# Altium schematic sheet io.SchDoc
size A3; SheetNumber: 3; SheetTotal: 4
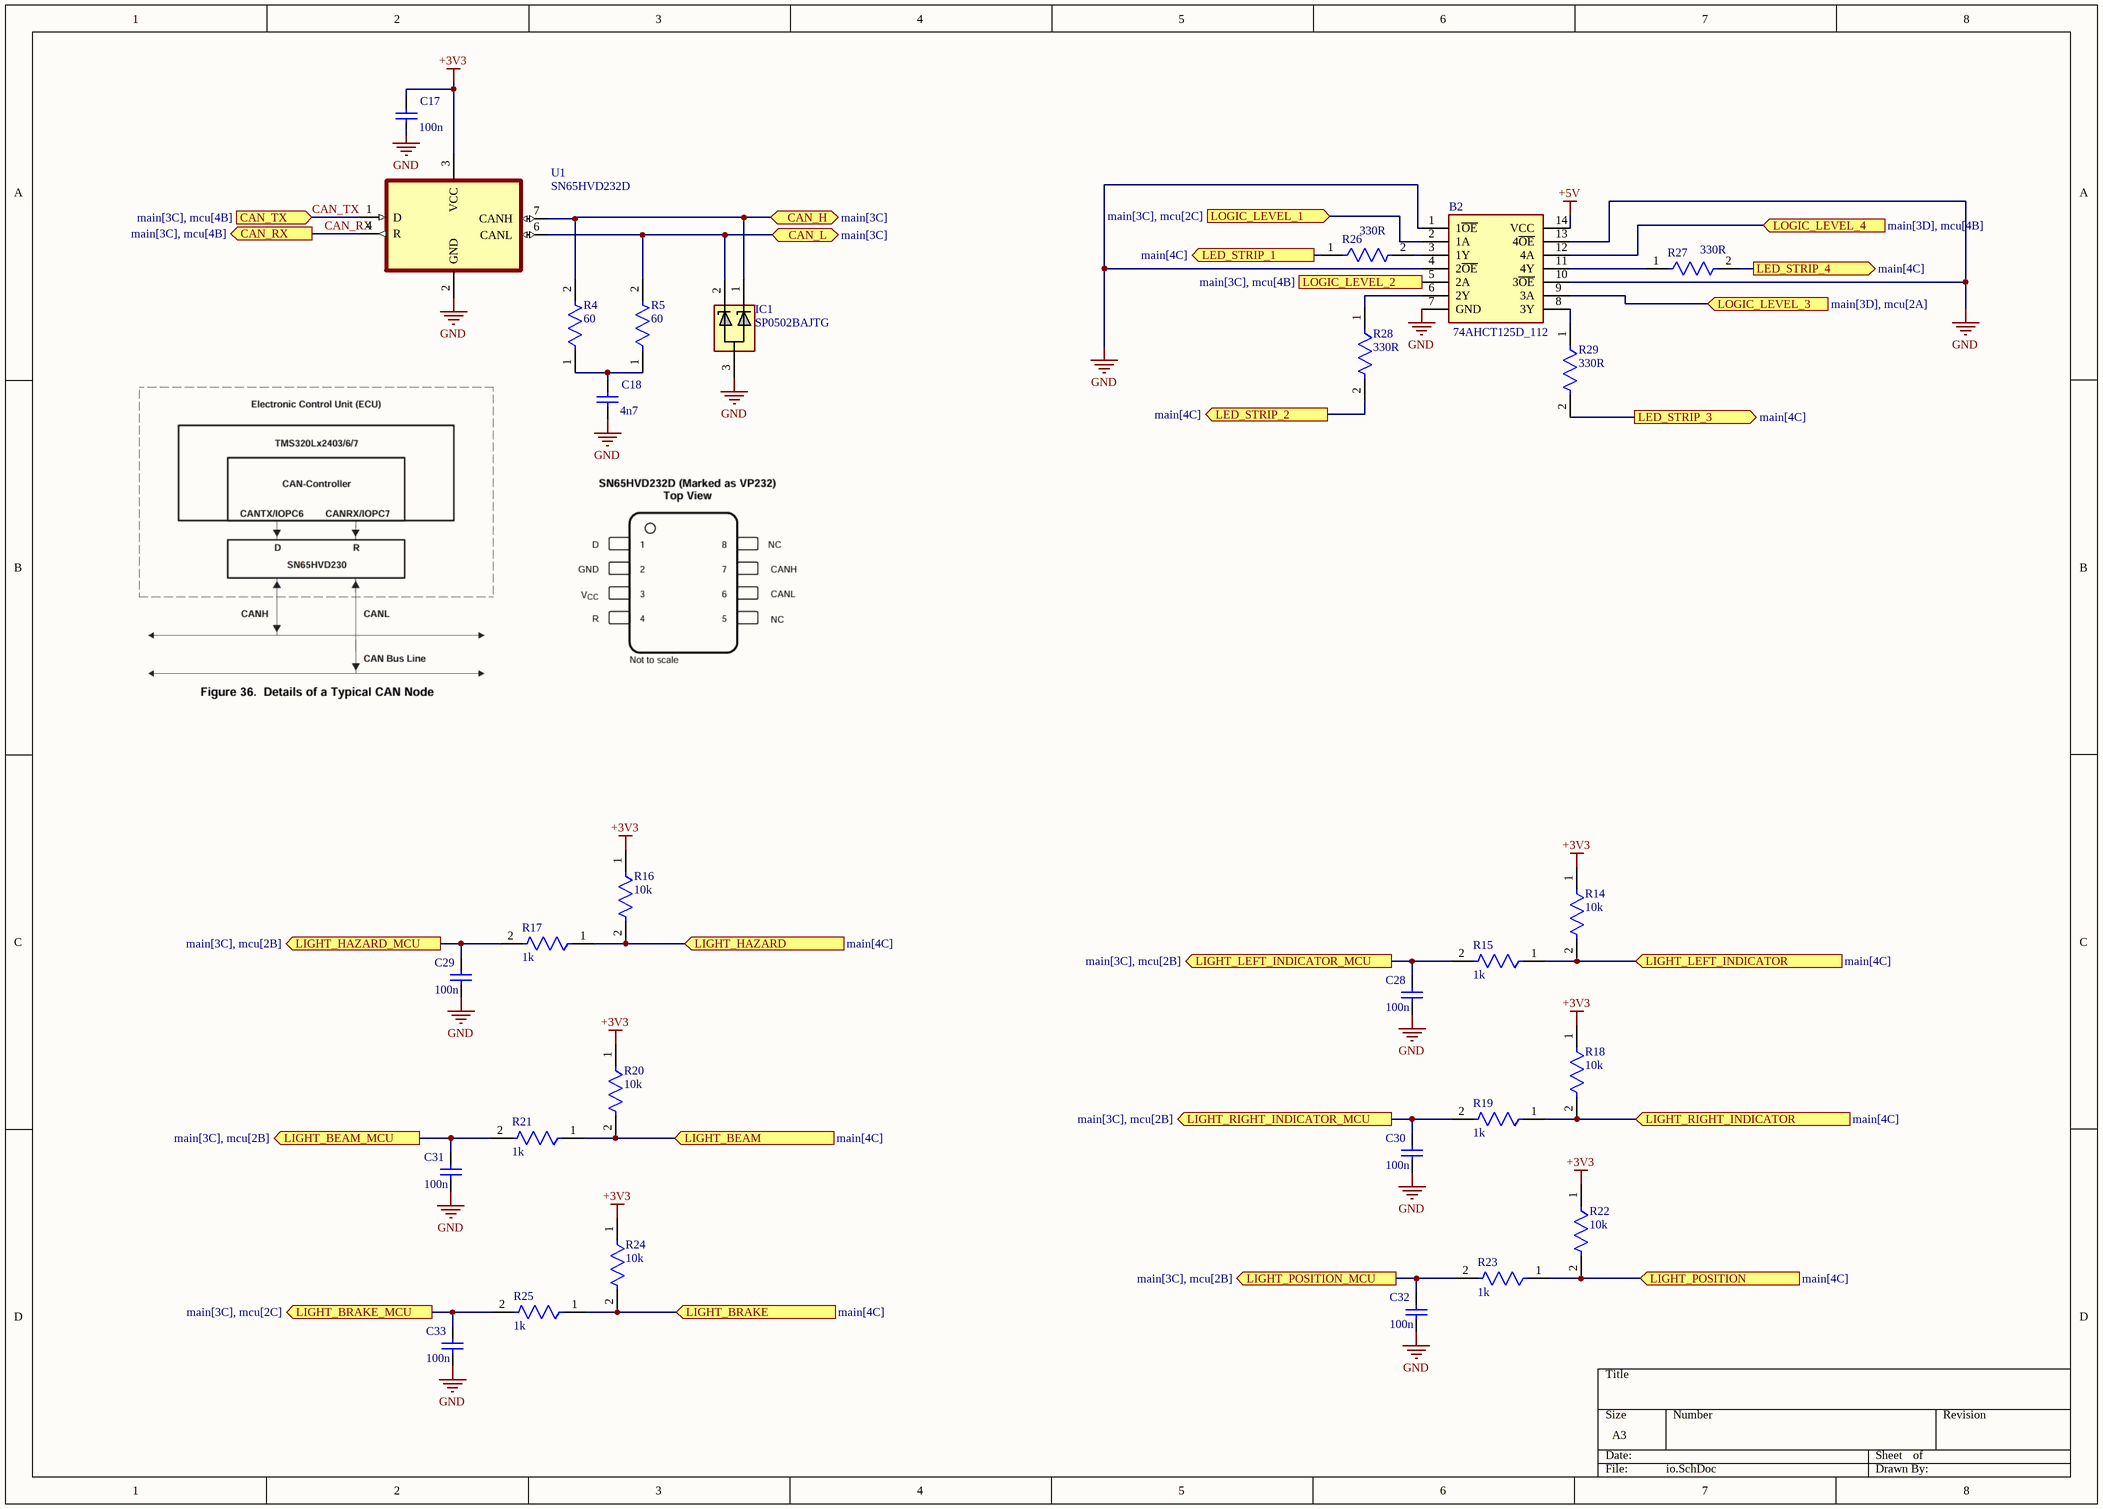
[diagram p0: io.SchDoc]

## Parts
B2  74AHCT125D_112  [74AHCT125D_112]
C17  100n  [CAPC1206(3216)150_L]
C18  4n7  [CAPC1206(3216)150_L]
C28  100n  [CAPC1206(3216)150_L]
C29  100n  [CAPC1206(3216)150_L]
C30  100n  [CAPC1206(3216)150_L]
C31  100n  [CAPC1206(3216)150_L]
C32  100n  [CAPC1206(3216)150_L]
C33  100n  [CAPC1206(3216)150_L]
IC1  SP0502BAJTG  [SOT132P220X110-3N]
R4  60  [FP-RK73H2B-MFG]
R5  60  [FP-RK73H2B-MFG]
R14  10k  [FP-RK73H2B-MFG]
R15  1k  [FP-RK73H2B-MFG]
R16  10k  [FP-RK73H2B-MFG]
R17  1k  [FP-RK73H2B-MFG]
R18  10k  [FP-RK73H2B-MFG]
R19  1k  [FP-RK73H2B-MFG]
R20  10k  [FP-RK73H2B-MFG]
R21  1k  [FP-RK73H2B-MFG]
R22  10k  [FP-RK73H2B-MFG]
R23  1k  [FP-RK73H2B-MFG]
R24  10k  [FP-RK73H2B-MFG]
R25  1k  [FP-RK73H2B-MFG]
R26  330R  [FP-RK73H2B-MFG]
R27  330R  [FP-RK73H2B-MFG]
R28  330R  [FP-RK73H2B-MFG]
R29  330R  [FP-RK73H2B-MFG]
U1  SN65HVD232D  [SN65HVD232D]

## Ports
CAN_H (bidir, see main[3C]), CAN_L (bidir, see main[3C]), CAN_RX (out, see main[3C], mcu[4B]), CAN_TX (in, see main[3C], mcu[4B]), LED_STRIP_1 (out, see main[4C]), LED_STRIP_2 (out, see main[4C]), LED_STRIP_3 (out, see main[4C]), LED_STRIP_4 (out, see main[4C]), LIGHT_BEAM (in, see main[4C]), LIGHT_BEAM_MCU (out, see main[3C], mcu[2B]), LIGHT_BRAKE (in, see main[4C]), LIGHT_BRAKE_MCU (out, see main[3C], mcu[2C]), LIGHT_HAZARD (in, see main[4C]), LIGHT_HAZARD_MCU (out, see main[3C], mcu[2B]), LIGHT_LEFT_INDICATOR (in, see main[4C]), LIGHT_LEFT_INDICATOR_MCU (out, see main[3C], mcu[2B]), LIGHT_POSITION (in, see main[4C]), LIGHT_POSITION_MCU (out, see main[3C], mcu[2B]), LIGHT_RIGHT_INDICATOR (in, see main[4C]), LIGHT_RIGHT_INDICATOR_MCU (out, see main[3C], mcu[2B]), LOGIC_LEVEL_1 (in, see main[3C], mcu[2C]), LOGIC_LEVEL_2 (in, see main[3C], mcu[4B]), LOGIC_LEVEL_3 (in, see main[3D], mcu[2A]), LOGIC_LEVEL_4 (in, see main[3D], mcu[4B])

## Nets
+3V3: C17.1 R14.1 R16.1 R18.1 R20.1 R22.1 R24.1 U1.3(VCC)
+5V: B2.14(VCC)
GND: B2.1(1~{OE}) B2.4(2~{OE}) B2.7(GND) B2.10(3~{OE}) B2.13(4~{OE}) C17.2 C18.2 C28.2 C29.2 C30.2 C31.2 C32.2 C33.2 IC1.3 U1.2(GND)
CAN_H: IC1.1 R4.2 U1.7(CANH) ; port CAN_H
CAN_L: IC1.2 R5.2 U1.6(CANL) ; port CAN_L
CAN_RX: U1.4(R) ; port CAN_RX
CAN_TX: U1.1(D) ; port CAN_TX
LED_STRIP_1: R26.1 ; port LED_STRIP_1
LED_STRIP_2: R28.2 ; port LED_STRIP_2
LED_STRIP_3: R29.2 ; port LED_STRIP_3
LED_STRIP_4: R27.2 ; port LED_STRIP_4
LIGHT_BEAM: R20.2 R21.1 ; port LIGHT_BEAM
LIGHT_BEAM_MCU: C31.1 R21.2 ; port LIGHT_BEAM_MCU
LIGHT_BRAKE: R24.2 R25.1 ; port LIGHT_BRAKE
LIGHT_BRAKE_MCU: C33.1 R25.2 ; port LIGHT_BRAKE_MCU
LIGHT_HAZARD: R16.2 R17.1 ; port LIGHT_HAZARD
LIGHT_HAZARD_MCU: C29.1 R17.2 ; port LIGHT_HAZARD_MCU
LIGHT_LEFT_INDICATOR: R14.2 R15.1 ; port LIGHT_LEFT_INDICATOR
LIGHT_LEFT_INDICATOR_MCU: C28.1 R15.2 ; port LIGHT_LEFT_INDICATOR_MCU
LIGHT_POSITION: R22.2 R23.1 ; port LIGHT_POSITION
LIGHT_POSITION_MCU: C32.1 R23.2 ; port LIGHT_POSITION_MCU
LIGHT_RIGHT_INDICATOR: R18.2 R19.1 ; port LIGHT_RIGHT_INDICATOR
LIGHT_RIGHT_INDICATOR_MCU: C30.1 R19.2 ; port LIGHT_RIGHT_INDICATOR_MCU
LOGIC_LEVEL_1: B2.2(1A) ; port LOGIC_LEVEL_1
LOGIC_LEVEL_2: B2.5(2A) ; port LOGIC_LEVEL_2
LOGIC_LEVEL_3: B2.9(3A) ; port LOGIC_LEVEL_3
LOGIC_LEVEL_4: B2.12(4A) ; port LOGIC_LEVEL_4
NetB2_3: B2.3(1Y) R26.2
NetB2_6: B2.6(2Y) R28.1
NetB2_8: B2.8(3Y) R29.1
NetB2_11: B2.11(4Y) R27.1
NetC18_1: C18.1 R4.1 R5.1

## Library data of the parts
B2 = 74AHCT125D_112: 74AHC(T)125 - Quad buffer/line driver; 3-state@en-us; Manufacturer_Name: Nexperia; Manufacturer_Part_Number: 74AHCT125D,112; Geometry.Height: 1.75mm; Mouser Part Number: 771-AHCT125D112; Mouser Price/Stock: https://www.mouser.com/Search/Refine.aspx?Keyword=771-AHCT125D112; Arrow Part Number: 74AHCT125D,112; Arrow Price/Stock: https://www.arrow.com/en/products/74ahct125d112/nexperia?region=europe; Datasheet Link: https://assets.nexperia.com/documents/data-sheet/74AHC_AHCT125.pdf
C17 C18 C28-C33 = CMP-1037-04778-1: CAP 1.8uF 10V ±5% 1206 (3216 Metric) Thickness 1.45mm SMD; Case-EIA: 1206; Tolerance: Â±5%; Case-Metric: 3216; Technology: SMT; Value: 1.8uF; Rated Voltage: 10 V; Max Thickness: 1.45 mm
IC1 = SP0502BAJTG: Integrated Circuit; Manufacturer_Name: LITTELFUSE; Datasheet Link: https://www.littelfuse.com/~/media/electronics/datasheets/tvs_diode_arrays/littelfuse_tvs_diode_array_sp05_datasheet.pdf.pdf; Height: 1.1mm; Manufacturer_Part_Number: SP0502BAJTG; Mouser Part Number: 576-SP0502BAJTG; Mouser Price/Stock: https://www.mouser.co.uk/ProductDetail/Littelfuse/SP0502BAJTG?qs=RnOBYWd%2Fz7cttN1Mwg4HWA%3D%3D; Arrow Part Number: SP0502BAJTG; Arrow Price/Stock: https://www.arrow.com/en/products/sp0502bajtg/littelfuse?region=nac
R4 R5 R14-R29 = CMP-04015-098385-1: 40.2kΩ ±1% 0.25W Chip Resistor 1206 Thick Film AEC-Q200 Qualified; Resistance: 40.2kR; Voltage Rating (DC): 200V; Temperature Coefficient: 100ppm/°C; Power Rating: 250mW; Tolerance: 1%; Package Quantity: 5000; Length: 3.2mm; Termination: SMD/SMT; Lead Free: Contains Lead; Case Code (Imperial): 1206; Case/Package: 1206; Voltage Rating: 200V; Case Code (Metric): 3216; Max Operating Temperature: 155°C; Packaging: Tape and Reel; Width: 1.6mm; Series: RK73H; Min Operating Temperature: -55°C; RoHS Compliant: No; Height: 0.6mm
U1 = SN65HVD232D: Texas Instruments - SN65HVD232DR - Can Transceiver, 1MBPS, 1/1, 3.3V, SOIC-8, Full Reel; Manufacturer Lifecycle Status: ACTIVE; Max Supply Voltage: 3.6V; Min Supply Voltage: 3V; Nominal Supply Current: 17mA; Number of Drivers: 1; SnapEDA_Link: https://www.snapeda.com/parts/SN65HVD232D/Texas+Instruments/view-part/?ref=snap; Package: SOIC-8 Texas Instruments; Value: *; MF: Texas Instruments; MP: SN65HVD232D; Check_prices: https://www.snapeda.com/parts/SN65HVD232D/Texas+Instruments/view-part/?ref=eda; Supplier: Arrow Electronics; Supplier Part Number: SN65HVD232DR; Manufacturer: Texas Instruments; Manufacturer Part Number: SN65HVD232DR; RoHS: Compliant; Category: CAN Transceivers; Stock: 10000; Pricing: 2500=1,1159, 5000=1,076, 7500=1,062 (USD); Case/Package: SOIC; Data Rate: 1Mbps; Height: 1.75mm; Lead Free: Lead Free; Length: 4.9mm; Lifecycle Status: Production; Max Operating Temperature: 85°C; Min Operating Temperature: -40°C; Pins: 8; Number of Receive Buffers: 1; Number of Receivers: 1; Number of Transceivers: 1; Number of Transmit Buffers: 1; Packaging: Cut Tape; Radiation Hardening: No; REACH SVHC: No; Schedule B: 8542390000, 8542390000|8542390000|8542390000|8542390000|8542390000; Thickness: 1.58mm; Weight: 72.603129mg; Width: 3.91mm; ComponentLink1URL: https://octopart.com:443/opatz8j6/c1?t=KNMFt9M64p-_id6rZ0-P1CX6CGmvk_NFg0bt7DHXbi_P10EFF0MZE_9gM8ERckOxIywTBgDrXd4Bw1XwEAcVVdK92p9CEfdSNaVajf6_bxnez3EeN1RE1wZBaojbXTwQ_101S7Bb856c3hUAWErS0_zGIM1B6Z6dFQwv_Ps2SUdVVUCjmJkLnMLZKTBWfnIVcgJIheW78JYanUyW_1u-I93chBuiSPXQYIk2xXb9JgOyrE9lHEnesRSQq9luJOd1yknyGQP0N3Is0_dGM9QrGV5UOgjoada9tMnQwKJP8gahr3iTK59XJFH6OfbHTOm3R9BdESCrBMbrE2MVOGPPkVOTrqf0YMovDpmf-konbncFnSES8CNOhHqMwHv2HEwKcPoK44nl&src-supplier=Texas+Instruments; ComponentLink1Description: https://octopart.com:443/opatz8j6/c1?t=KNMFt9M64p-_id6rZ0-P1CX6CGmvk_NFg0bt7DHXbi_P10EFF0MZE_9gM8ERckOxIywTBgDrXd4Bw1XwEAcVVdK92p9CEfdSNaVajf6_bxnez3EeN1RE1wZBaojbXTwQ_101S7Bb856c3hUAWErS0_zGIM1B6Z6dFQwv_Ps2SUdVVUCjmJkLnMLZKTBWfnIVcgJIheW78JYanUyW_1u-I93chBuiSPXQYIk2xXb9JgOyrE9lHEnesRSQq9luJOd1yknyGQP0N3Is0_dGM9QrGV5UOgjoada9tMnQwKJP8gahr3iTK59XJFH6OfbHTOm3R9BdESCrBMbrE2MVOGPPkVOTrqf0YMovDpmf-konbncFnSES8CNOhHqMwHv2HEwKcPoK44nl&src-supplier=Texas+Instruments; ComponentLink2URL: https://sigma.octopart.com:443/49249642/technical_drawing/Texas-Instruments-SN65HVD232DR.pdf?src-supplier=Texas+Instruments; ComponentLink2Description: https://sigma.octopart.com:443/49249642/technical_drawing/Texas-Instruments-SN65HVD232DR.pdf?src-supplier=Texas+Instruments; ComponentLink3URL: https://datasheet.octopart.com:443/SN65HVD232DR-Texas-Instruments-datasheet-81447765.pdf?src-supplier=Upverter; ComponentLink3Description: https://datasheet.octopart.com:443/SN65HVD232DR-Texas-Instruments-datasheet-81447765.pdf?src-supplier=Upverter; ComponentLink4URL: https://datasheet.octopart.com:443/SN65HVD232DR-Texas-Instruments-datasheet-37140773.pdf?src-supplier=Newark; ComponentLink4Description: https://datasheet.octopart.com:443/SN65HVD232DR-Texas-Instruments-datasheet-37140773.pdf?src-supplier=Newark; ComponentLink5URL: https://datasheet.octopart.com:443/SN65HVD232DR-Texas-Instruments-datasheet-14436966.pdf?src-supplier=Newark; ComponentLink5Description: https://datasheet.octopart.com:443/SN65HVD232DR-Texas-Instruments-datasheet-14436966.pdf?src-supplier=Newark; ComponentLink6URL: https://datasheet.octopart.com:443/SN65HVD232DR-Texas-Instruments-datasheet-58296547.pdf?src-supplier=Newark; ComponentLink6Description: https://datasheet.octopart.com:443/SN65HVD232DR-Texas-Instruments-datasheet-58296547.pdf?src-supplier=Newark; ComponentLink7URL: https://datasheet.octopart.com:443/SN65HVD232DR-Texas-Instruments-datasheet-48117850.pdf?src-supplier=Newark; ComponentLink7Description: https://datasheet.octopart.com:443/SN65HVD232DR-Texas-Instruments-datasheet-48117850.pdf?src-supplier=Newark; ComponentLink8URL: https://datasheet.octopart.com:443/SN65HVD232DR-Texas-Instruments-datasheet-10256024.pdf?src-supplier=Arrow+Electronics; ComponentLink8Description: https://datasheet.octopart.com:443/SN65HVD232DR-Texas-Instruments-datasheet-10256024.pdf?src-supplier=Arrow+Electronics; ComponentLink9URL: https://datasheet.octopart.com:443/SN65HVD232DR-Texas-Instruments-datasheet-149765.pdf?src-supplier=Mouser; ComponentLink9Description: https://datasheet.octopart.com:443/SN65HVD232DR-Texas-Instruments-datasheet-149765.pdf?src-supplier=Mouser; ComponentLink10URL: https://datasheet.octopart.com:443/SN65HVD232DR-Texas-Instruments-datasheet-62292544.pdf?src-supplier=Farnell; ComponentLink10Description: https://datasheet.octopart.com:443/SN65HVD232DR-Texas-Instruments-datasheet-62292544.pdf?src-supplier=Farnell; ComponentLink11URL: https://datasheet.octopart.com:443/SN65HVD232DR-Texas-Instruments-datasheet-164416263.pdf?src-supplier=SHENGYU+ELECTRONICS; ComponentLink11Description: https://datasheet.octopart.com:443/SN65HVD232DR-Texas-Instruments-datasheet-164416263.pdf?src-supplier=SHENGYU+ELECTRONICS; ComponentLink12URL: https://datasheet.octopart.com:443/SN65HVD232DR-Texas-Instruments-datasheet-159115712.pdf?src-supplier=LCSC; ComponentLink12Description: https://datasheet.octopart.com:443/SN65HVD232DR-Texas-Instruments-datasheet-159115712.pdf?src-supplier=LCSC; ComponentLink13URL: https://datasheet.octopart.com:443/SN65HVD232DR-Texas-Instruments-datasheet-137316104.pdf?src-supplier=Future+Electronics; ComponentLink13Description: https://datasheet.octopart.com:443/SN65HVD232DR-Texas-Instruments-datasheet-137316104.pdf?src-supplier=Future+Electronics; ComponentLink14URL: https://datasheet.octopart.com:443/SN65HVD232DR-Texas-Instruments-datasheet-8625468.pdf?src-supplier=Verical; ComponentLink14Description: https://datasheet.octopart.com:443/SN65HVD232DR-Texas-Instruments-datasheet-8625468.pdf?src-supplier=Verical; ComponentLink15URL: https://datasheet.octopart.com:443/SN65HVD232DR-Texas-Instruments-datasheet-8378736.pdf?src-supplier=Verical; ComponentLink15Description: https://datasheet.octopart.com:443/SN65HVD232DR-Texas-Instruments-datasheet-8378736.pdf?src-supplier=Verical; ComponentLink16URL: http://sigma.octopart.com:80/conflict_mineral_statement/Texas-Instruments-company-63.pdf?src-supplier=Compliance+Statements; ComponentLink16Description: http://sigma.octopart.com:80/conflict_mineral_statement/Texas-Instruments-company-63.pdf?src-supplier=Compliance+Statements; ComponentLink17URL: http://sigma.octopart.com:80/reach_statement/Texas-Instruments-company-64.pdf?src-supplier=Compliance+Statements; ComponentLink17Description: http://sigma.octopart.com:80/reach_statement/Texas-Instruments-company-64.pdf?src-supplier=Compliance+Statements